# Altium schematic sheet MCU_GATEWAY.SchDoc
size A
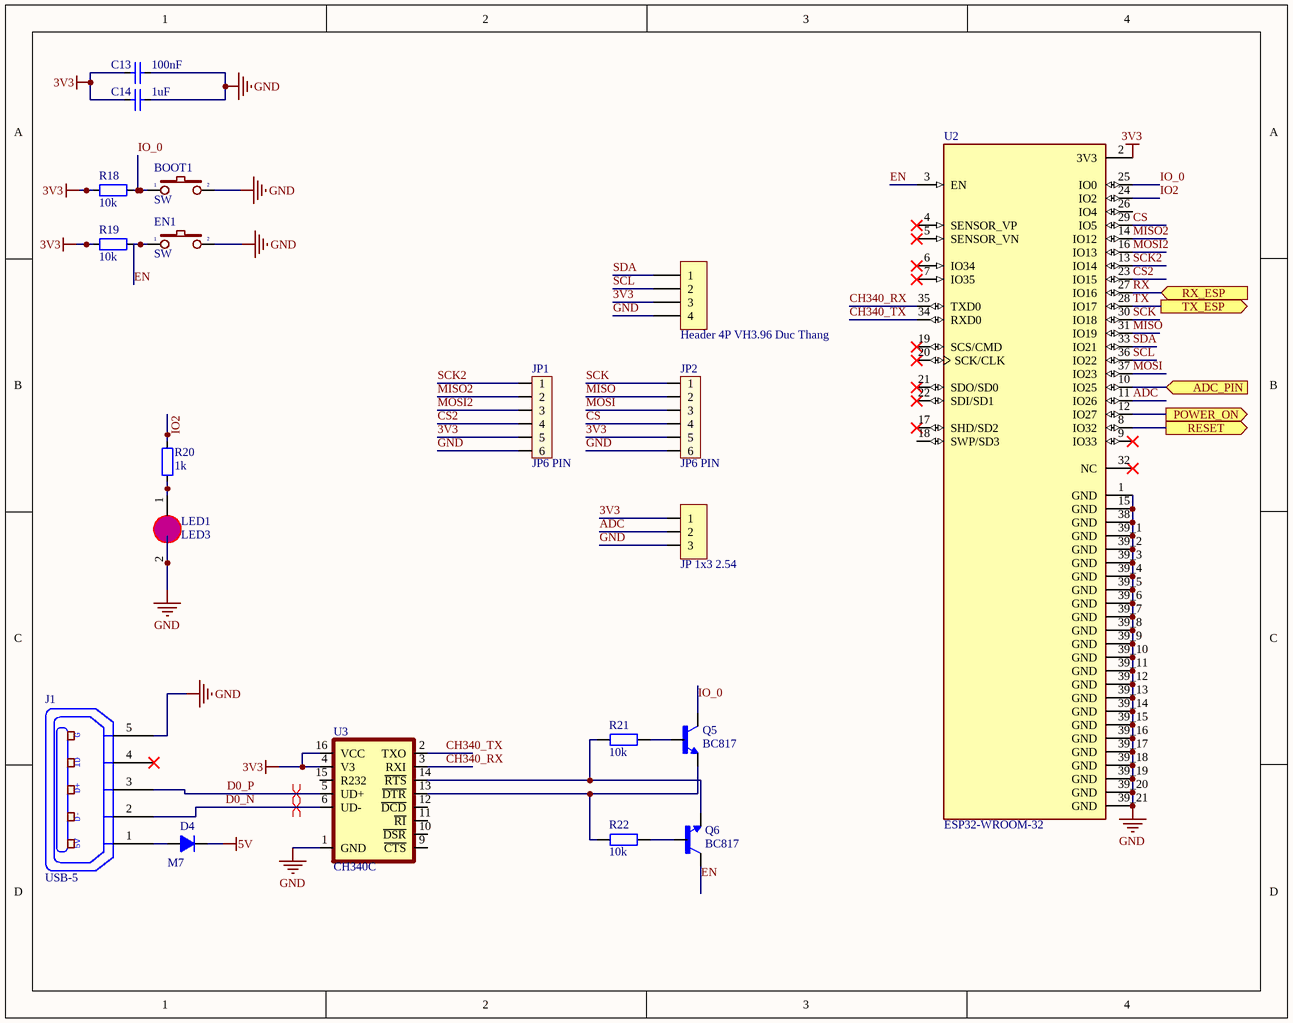
[diagram p0: MCU_GATEWAY.SchDoc]

## Parts
BOOT1  SW  [SW-SMD]
C13  100nF  [CAP_0805]
C14  1uF  [CAP_0805]
D4  M7  [SMA]
EN1  SW  [SW-SMD]
H1  Header 4P VH3.96 Duc Thang  [CON4]
J1  USB-5  [USB-M1]
JP1  JP6 PIN  [Header6]
JP2  JP6 PIN  [Header6]
JP3  JP 1x3 2.54  [JP3]
LED1  LED3  [LED0805]
Q5  BC817  [SOT95P240X97-3N]
Q6  BC817  [SOT95P240X97-3N]
R18  10k  [RES-SMD-0805]
R19  10k  [RES-SMD-0805]
R20  1k  [RES-SMD-0805]
R21  10k  [RES-SMD-0805]
R22  10k  [RES-SMD-0805]
U2  ESP32-WROOM-32  [MODULE_ESP32-WROOM-32]
U3  CH340C  [SOP-16]

## Ports
ADC_PIN (in), POWER_ON (out), RESET (out), RX_ESP (in), TX_ESP (out)

## Nets
3V3: C13.1 C14.1 H1.3 JP1.5 JP2.5 JP3.1 R18.1 R19.1 U2.2(3V3) U3.4(V3) U3.16(VCC)
5V: D4.2(K)
GND: BOOT1.2 C13.2 C14.2 EN1.2 H1.4 J1.5(P5) JP1.6 JP2.6 JP3.3 LED1.2(K) U2.1(GND) U2.15(GND) U2.38(GND) U2.39_1(GND) U2.39_2(GND) U2.39_3(GND) U2.39_4(GND) U2.39_5(GND) U2.39_6(GND) U2.39_7(GND) U2.39_8(GND) U2.39_9(GND) U2.39_10(GND) U2.39_11(GND) U2.39_12(GND) U2.39_13(GND) U2.39_14(GND) U2.39_15(GND) U2.39_16(GND) U2.39_17(GND) U2.39_18(GND) U2.39_19(GND) U2.39_20(GND) U2.39_21(GND) U3.1(GND)
ADC: JP3.2 U2.11(IO26)
ADC_PIN: U2.10(IO25) ; port ADC_PIN
CH340_RX: U2.35(TXD0) U3.3(RXI)
CH340_TX: U2.34(RXD0) U3.2(TXO)
CS: JP2.4 U2.29(IO5)
CS2: JP1.4 U2.23(IO15)
D0_N: J1.2(P2) U3.6(UD-)
D0_P: J1.3(P3) U3.5(UD+)
EN: EN1.1 Q6.3(C) R19.2 U2.3(EN)
IO2: R20.1 U2.24(IO2)
IO_0: BOOT1.1 Q5.3(C) R18.2 U2.25(IO0)
MISO: JP2.2 U2.31(IO19)
MISO2: JP1.2 U2.14(IO12)
MOSI: JP2.3 U2.37(IO23)
MOSI2: JP1.3 U2.16(IO13)
POWER_ON: U2.12(IO27) ; port POWER_ON
RESET: U2.8(IO32) ; port RESET
RX: U2.27(IO16) ; port RX_ESP
SCK: JP2.1 U2.30(IO18)
SCK2: JP1.1 U2.13(IO14)
SCL: H1.2 U2.36(IO22)
SDA: H1.1 U2.33(IO21)
TX: U2.28(IO17) ; port TX_ESP
NetD4_1: D4.1(A) J1.1(P1)
NetLED1_1: LED1.1(A) R20.2
NetQ5_1: Q5.1(B) R21.2
NetQ5_2: Q5.2(E) R22.1 U3.13(~{DTR})
NetQ6_1: Q6.1(B) R22.2
NetQ6_2: Q6.2(E) R21.1 U3.14(~{RTS})

Not connected (* = marked no-connect by the designer): J1 4(P4)*; U2 4(SENSOR_VP)* 5(SENSOR_VN)* 6(IO34)* 7(IO35)* 9(IO33)* 17(SHD/SD2)* 18(SWP/SD3) 19(SCS/CMD)* 20(SCK/CLK)* 21(SDO/SD0)* 22(SDI/SD1)* 26(IO4) 32(NC)*; U3 9(~{CTS}) 10(~{DSR}) 11(~{RI}) 12(~{DCD}) 15(R232)

## Layout directives
differential pair: D0_N, D0_P

## Notes on the sheet
- (in symbol USB-5) G; ID; D+; D-; 5V

## Library data of the parts
BOOT1 EN1 = SW2: Switch button 2 pin; Value: SW chip 2 pin
C13 C14 = CapSMD: Capacitor; Value: 33p; Published: 8-Jun-2000; LatestRevisionDate: 17-Jul-2002; LatestRevisionNote: Re-released for DXP Platform.; PackageReference: RAD-0.3; Publisher: Altium Limited
D4 = D1A: Diode 1A; Value: 1N4007
H1 = Header 4P VH3.96 Duc Thang: Cắm; Ten_Linh_Kien: Header 4P XH2.54-4P Đực Thẳng; Don_Vi: Con; Ma_Hang: MH001285; Chung_Loai: Cắm
J1 = USB-5: Manufacturer: FCI; Manufacturer Part Number: 10118193-0001LF; Connector Type: USB - micro B; Number of Contacts: 5; Gender: Receptacle; Specifications: USB 2.0; .Creator: MM; .Checked PCB: RF; Supplier 1: Digi-Key; RoHS: RoHS Compliant; Category: Connectors, Interconnects; Stock 1: 28642; Pricing 1: 1=0.46, 10=0.433, 25=0.3712, 50=0.3156, 100=0.3032, 250=0.27224, 500=0.25988 (USD); Packaging: Cut Tape (CT); Mounting Type: Surface Mount, Right Angle, Horizontal; Features: Shielded, Solder Retention; Ingress Protection: -; ComponentLink1URL: http://portal.fciconnect.com/Comergent//fci/drawing/10118193.pdf; ComponentLink1Description: http://portal.fciconnect.com/Comergent//fci/drawing/10118193.pdf; Supplier Part Number 1: 609-4616-1-ND; .Checked SCH: MM
JP1 JP2 = JP6: Value: JP7
JP3 = JP 1x3 2.54 Cai Thang: Cắm; Ten_Linh_Kien: Jump Đơn Cái 2.54MM 1x20P Thẳng; Don_Vi: Con; Ma_Hang: MH004006; Ghi_Chu: *; Kieu_Chan: *; Chung_Loai: Cắm
LED1 = LED0805: LED SMD 0805
Q5 Q6 = BC817: Bipolar (BJT) Transistor NPN 45V 500mA 100MHz 250mW Surface Mount TO-236AB; MF: Rectron; MP: BC817; Value: *; SnapEDA_Link: https://www.snapeda.com/parts/BC817/Rectron/view-part/?ref=snap; Availability: In Stock; Purchase-URL: https://pricing.snapeda.com/search/part/BC817/?ref=eda; Package: SOT-23-3 Rectron; Price: None; Check_prices: https://www.snapeda.com/parts/BC817/Rectron/view-part/?ref=eda
R18-R22 = Resistor - SMD: Resistor SMD; Manufacturer: Generic Components; Class: Passive; Published: 08/06/2000; Publisher: Altium Hobart Technology Centre
U2 = ESP32-WROOM-32: Bluetooth, WiFi 802.11b/g/n, Bluetooth v4.2 +EDR, Class 1, 2 and 3 Transceiver Module 2.4GHz ~ 2.5GHz Antenna Not Included, U.FL Surface Mount; MF: Espressif Systems; Price: None; Availability: In Stock; MP: ESP32-WROOM-32; Package: Module Espressif Systems; SnapEDA_Link: https://www.snapeda.com/parts/ESP32-WROOM-32/Espressif+Systems/view-part/?ref=snap; Check_prices: https://www.snapeda.com/parts/ESP32-WROOM-32/Espressif+Systems/view-part/?ref=eda; Value: *; Purchase-URL: https://pricing.snapeda.com/search/part/ESP32-WROOM-32/?ref=eda
U3 = CH340C: USB to serial chip CH340; MF: WCH; Package: Package; Check_prices: https://www.snapeda.com/parts/CH340C/WCH/view-part/5428851/?ref=eda; Value: *; Price: None; MP: CH340C; Availability: Unavailable; SnapEDA_Link: https://www.snapeda.com/parts/CH340C/WCH/view-part/5428851/?ref=snap